# Altium schematic sheet TOF.schdoc
size 168 x 127 mm
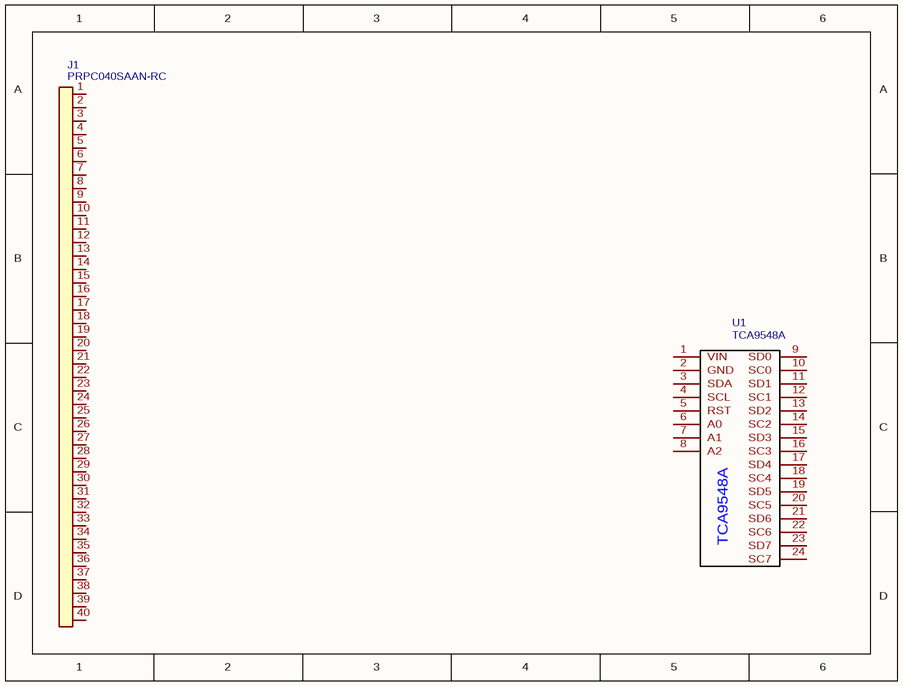
[diagram p0: TOF.schdoc]

## Parts
J1  PRPC040SAAN-RC  [PINHEADER_1X40_P2.54_DRILL1MM]
U1  TCA9548A  [TCA9548A]

## Nets

Not connected (* = marked no-connect by the designer): J1 1 2 3 4 5 6 7 8 9 10 11 12 13 14 15 16 17 18 19 20 21 22 23 24 25 26 27 28 29 30 31 32 33 34 35 36 37 38 39 40; U1 1(VIN) 2(GND) 3(SDA) 4(SCL) 5(RST) 6(A0) 7(A1) 8(A2) 9(SD0) 10(SC0) 11(SD1) 12(SC1) 13(SD2) 14(SC2) 15(SD3) 16(SC3) 17(SD4) 18(SC4) 19(SD5) 20(SC5) 21(SD6) 22(SC6) 23(SD7) 24(SC7)

## Library data of the parts
J1 = PRPC040SAAN-RC: Manufacturer: Sullins Connector Solutions; Contributor: morlan.lunsford; spicePre: J; spiceSymbolName: PRPC040SAAN-RC
U1 = TCA9548A: Manufacturer: Texas Instruments; Contributor: Dompie; Manufacturer Part: TCA9548A; Supplier: Adafruit; Supplier Part: 2717; link: https://www.adafruit.com/product/2717; spicePre: U; spiceSymbolName: TCA9548A